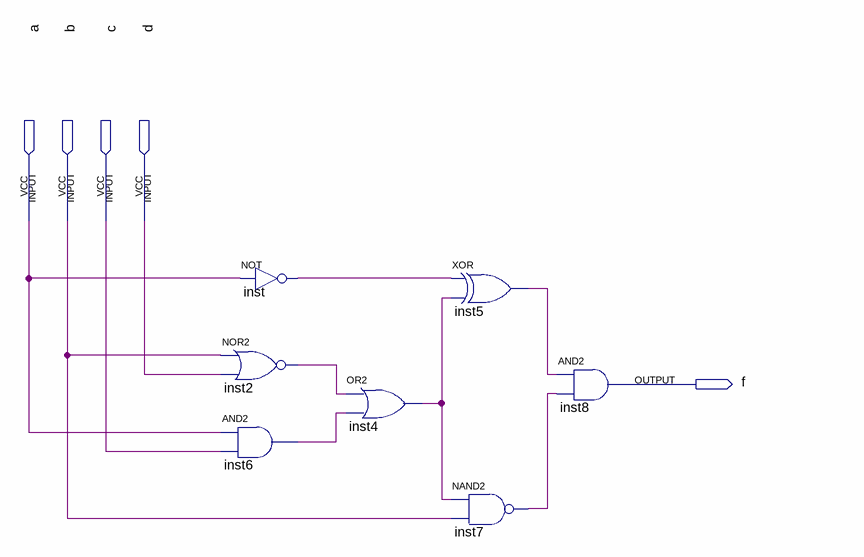
[diagram p0: schematic sheet]
// Quartus schematic q42.bdf as structural Verilog: 7 symbols, 5 pins
module q42 (
  input  a,
  input  b,
  input  c,
  input  d,
  output f
);

  wire inst2_out, inst4_out, inst5_out, inst6_out, inst7_out, inst_out;

  not inst (inst_out, a);
  nor inst2 (inst2_out, b, d);
  and inst6 (inst6_out, a, c);
  or inst4 (inst4_out, inst2_out, inst6_out);
  xor inst5 (inst5_out, inst_out, inst4_out);
  nand inst7 (inst7_out, inst4_out, b);
  and inst8 (f, inst5_out, inst7_out);
endmodule
